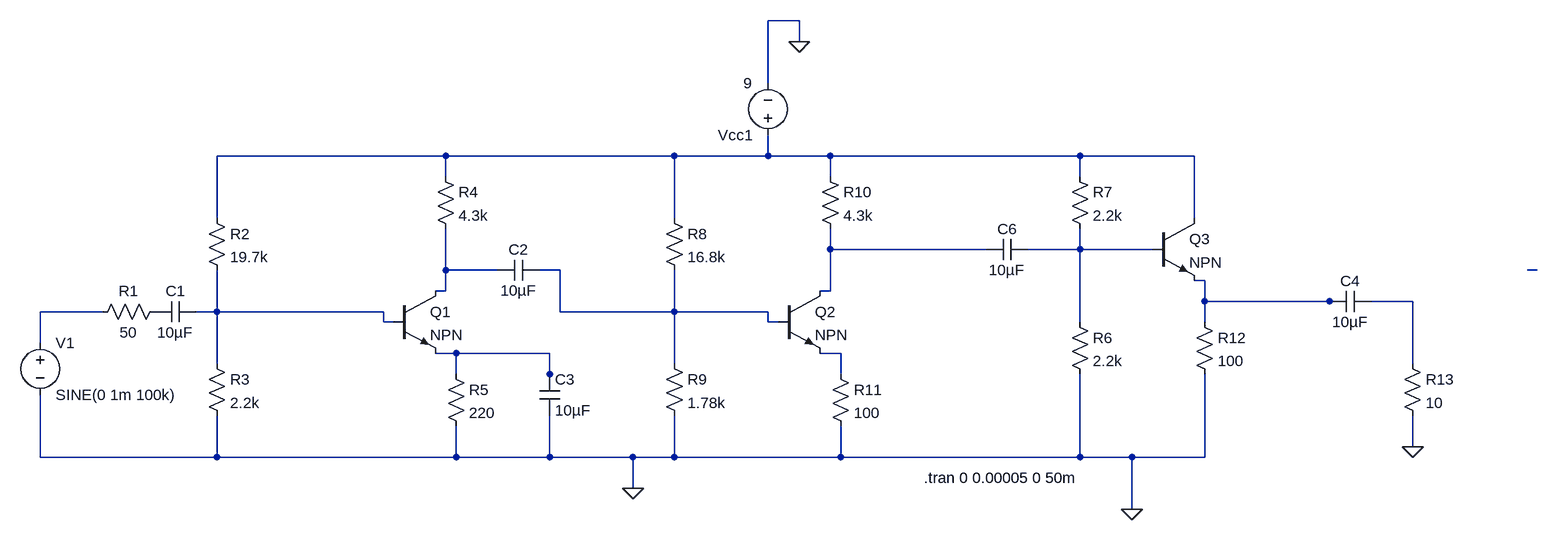
[diagram p0: schematic Audio Amp.asc]
Audio Amp.asc, the LTspice schematic file:
Version 4
SHEET 1 4300 1444
WIRE -144 -1072 -192 -1072
WIRE -144 -1040 -144 -1072
WIRE -192 -976 -192 -1072
WIRE -688 -864 -1040 -864
WIRE -336 -864 -688 -864
WIRE -192 -864 -192 -896
WIRE -192 -864 -336 -864
WIRE -96 -864 -192 -864
WIRE 288 -864 -96 -864
WIRE 464 -864 288 -864
WIRE -688 -832 -688 -864
WIRE -96 -832 -96 -864
WIRE 288 -832 288 -864
WIRE -1040 -768 -1040 -864
WIRE -336 -768 -336 -864
WIRE 464 -768 464 -864
WIRE -96 -720 -96 -752
WIRE 144 -720 -96 -720
WIRE 288 -720 288 -752
WIRE 288 -720 208 -720
WIRE 400 -720 288 -720
WIRE -688 -688 -688 -752
WIRE -608 -688 -688 -688
WIRE -512 -688 -544 -688
WIRE 992 -688 976 -688
WIRE 480 -672 464 -672
WIRE -688 -656 -688 -688
WIRE -688 -656 -704 -656
WIRE -96 -656 -96 -720
WIRE -96 -656 -112 -656
WIRE 480 -640 480 -672
WIRE 672 -640 480 -640
WIRE 688 -640 672 -640
WIRE 800 -640 736 -640
WIRE -1216 -624 -1312 -624
WIRE -1040 -624 -1040 -688
WIRE -1040 -624 -1072 -624
WIRE -784 -624 -1040 -624
WIRE -512 -624 -512 -688
WIRE -336 -624 -336 -688
WIRE -336 -624 -512 -624
WIRE -192 -624 -336 -624
WIRE -784 -608 -784 -624
WIRE -768 -608 -784 -608
WIRE -192 -608 -192 -624
WIRE -176 -608 -192 -608
WIRE 288 -608 288 -720
WIRE 480 -608 480 -640
WIRE -1312 -576 -1312 -624
WIRE -672 -560 -704 -560
WIRE -528 -560 -672 -560
WIRE -80 -560 -112 -560
WIRE -1040 -544 -1040 -624
WIRE -336 -544 -336 -624
WIRE 800 -544 800 -640
WIRE -672 -528 -672 -560
WIRE -528 -528 -528 -560
WIRE -80 -528 -80 -560
WIRE -528 -512 -528 -528
WIRE 800 -416 800 -464
WIRE -1312 -400 -1312 -496
WIRE -1040 -400 -1040 -464
WIRE -1040 -400 -1312 -400
WIRE -672 -400 -672 -448
WIRE -672 -400 -1040 -400
WIRE -528 -400 -528 -464
WIRE -528 -400 -672 -400
WIRE -400 -400 -528 -400
WIRE -336 -400 -336 -464
WIRE -336 -400 -400 -400
WIRE -80 -400 -80 -448
WIRE -80 -400 -336 -400
WIRE 288 -400 288 -528
WIRE 288 -400 -80 -400
WIRE 368 -400 288 -400
WIRE 480 -400 480 -528
WIRE 480 -400 368 -400
WIRE -400 -352 -400 -400
WIRE 368 -320 368 -400
FLAG -144 -1040 0
FLAG 800 -416 0
FLAG 368 -320 0
FLAG -400 -352 0
SYMBOL voltage -1312 -592 R0
WINDOW 123 0 0 Left 0
WINDOW 39 0 0 Left 0
SYMATTR InstName V1
SYMATTR Value SINE(0 1m 100k)
SYMBOL res -1120 -640 R90
WINDOW 0 0 56 VBottom 2
WINDOW 3 32 56 VTop 2
SYMATTR InstName R1
SYMATTR Value 50
SYMBOL cap -1072 -640 R90
WINDOW 0 0 32 VBottom 2
WINDOW 3 32 32 VTop 2
SYMATTR InstName C1
SYMATTR Value 10µF
SYMBOL res -1056 -784 R0
SYMATTR InstName R2
SYMATTR Value 19.7k
SYMBOL res -1056 -560 R0
SYMATTR InstName R3
SYMATTR Value 2.2k
SYMBOL npn -768 -656 R0
SYMATTR InstName Q1
SYMBOL res -704 -848 R0
SYMATTR InstName R4
SYMATTR Value 4.3k
SYMBOL res -688 -544 R0
SYMATTR InstName R5
SYMATTR Value 220
SYMBOL cap -544 -704 R90
WINDOW 0 0 32 VBottom 2
WINDOW 3 32 32 VTop 2
SYMATTR InstName C2
SYMATTR Value 10µF
SYMBOL cap -544 -528 R0
SYMATTR InstName C3
SYMATTR Value 10µF
SYMBOL res -352 -784 R0
SYMATTR InstName R8
SYMATTR Value 16.8k
SYMBOL res -352 -560 R0
SYMATTR InstName R9
SYMATTR Value 1.78k
SYMBOL npn -176 -656 R0
SYMATTR InstName Q2
SYMBOL res -112 -848 R0
SYMATTR InstName R10
SYMATTR Value 4.3k
SYMBOL res -96 -544 R0
SYMATTR InstName R11
SYMATTR Value 100
SYMBOL voltage -192 -880 R180
WINDOW 123 0 0 Left 0
WINDOW 39 0 0 Left 0
SYMATTR InstName Vcc1
SYMATTR Value 9
SYMBOL res 272 -624 R0
SYMATTR InstName R6
SYMATTR Value 2.2k
SYMBOL res 272 -848 R0
SYMATTR InstName R7
SYMATTR Value 2.2k
SYMBOL res 464 -624 R0
SYMATTR InstName R12
SYMATTR Value 100
SYMBOL npn 400 -768 R0
SYMATTR InstName Q3
SYMBOL cap 736 -656 R90
WINDOW 0 0 32 VBottom 2
WINDOW 3 32 32 VTop 2
SYMATTR InstName C4
SYMATTR Value 10µF
SYMBOL res 784 -560 R0
SYMATTR InstName R13
SYMATTR Value 10
SYMBOL cap 208 -736 R90
WINDOW 0 0 32 VBottom 2
WINDOW 3 32 32 VTop 2
SYMATTR InstName C6
SYMATTR Value 10µF
TEXT 48 -368 Left 2 !.tran 0 0.00005 0 50m

The netlist it stands for:
* Audio Amp.asc
V1 N009 0 SINE(0 1m 100k)
R1 P001 N009 50
C1 N010 P001 10µF
R2 N001 N010 19.7k
R3 N010 0 2.2k
Q1 N004 N010 N011 0 NPN
R4 N001 N004 4.3k
R5 N011 0 220
C2 N005 N004 10µF
C3 N011 0 10µF
R8 N001 N005 16.8k
R9 N005 0 1.78k
Q2 N002 N005 N012 0 NPN
R10 N001 N002 4.3k
R11 N012 0 100
Vcc1 N001 0 9
R6 N003 0 2.2k
R7 N001 N003 2.2k
R12 N007 0 100
Q3 N001 N003 N007 0 NPN
C4 N008 N007 10µF
R13 N008 0 10
C6 N003 N002 10µF
.model NPN NPN
.model PNP PNP
.lib standard.bjt
.tran 0 0.00005 0 50m
.backanno
.end